# EAGLE board TurboMaster-clean_noart (EAGLE 7.7.0)
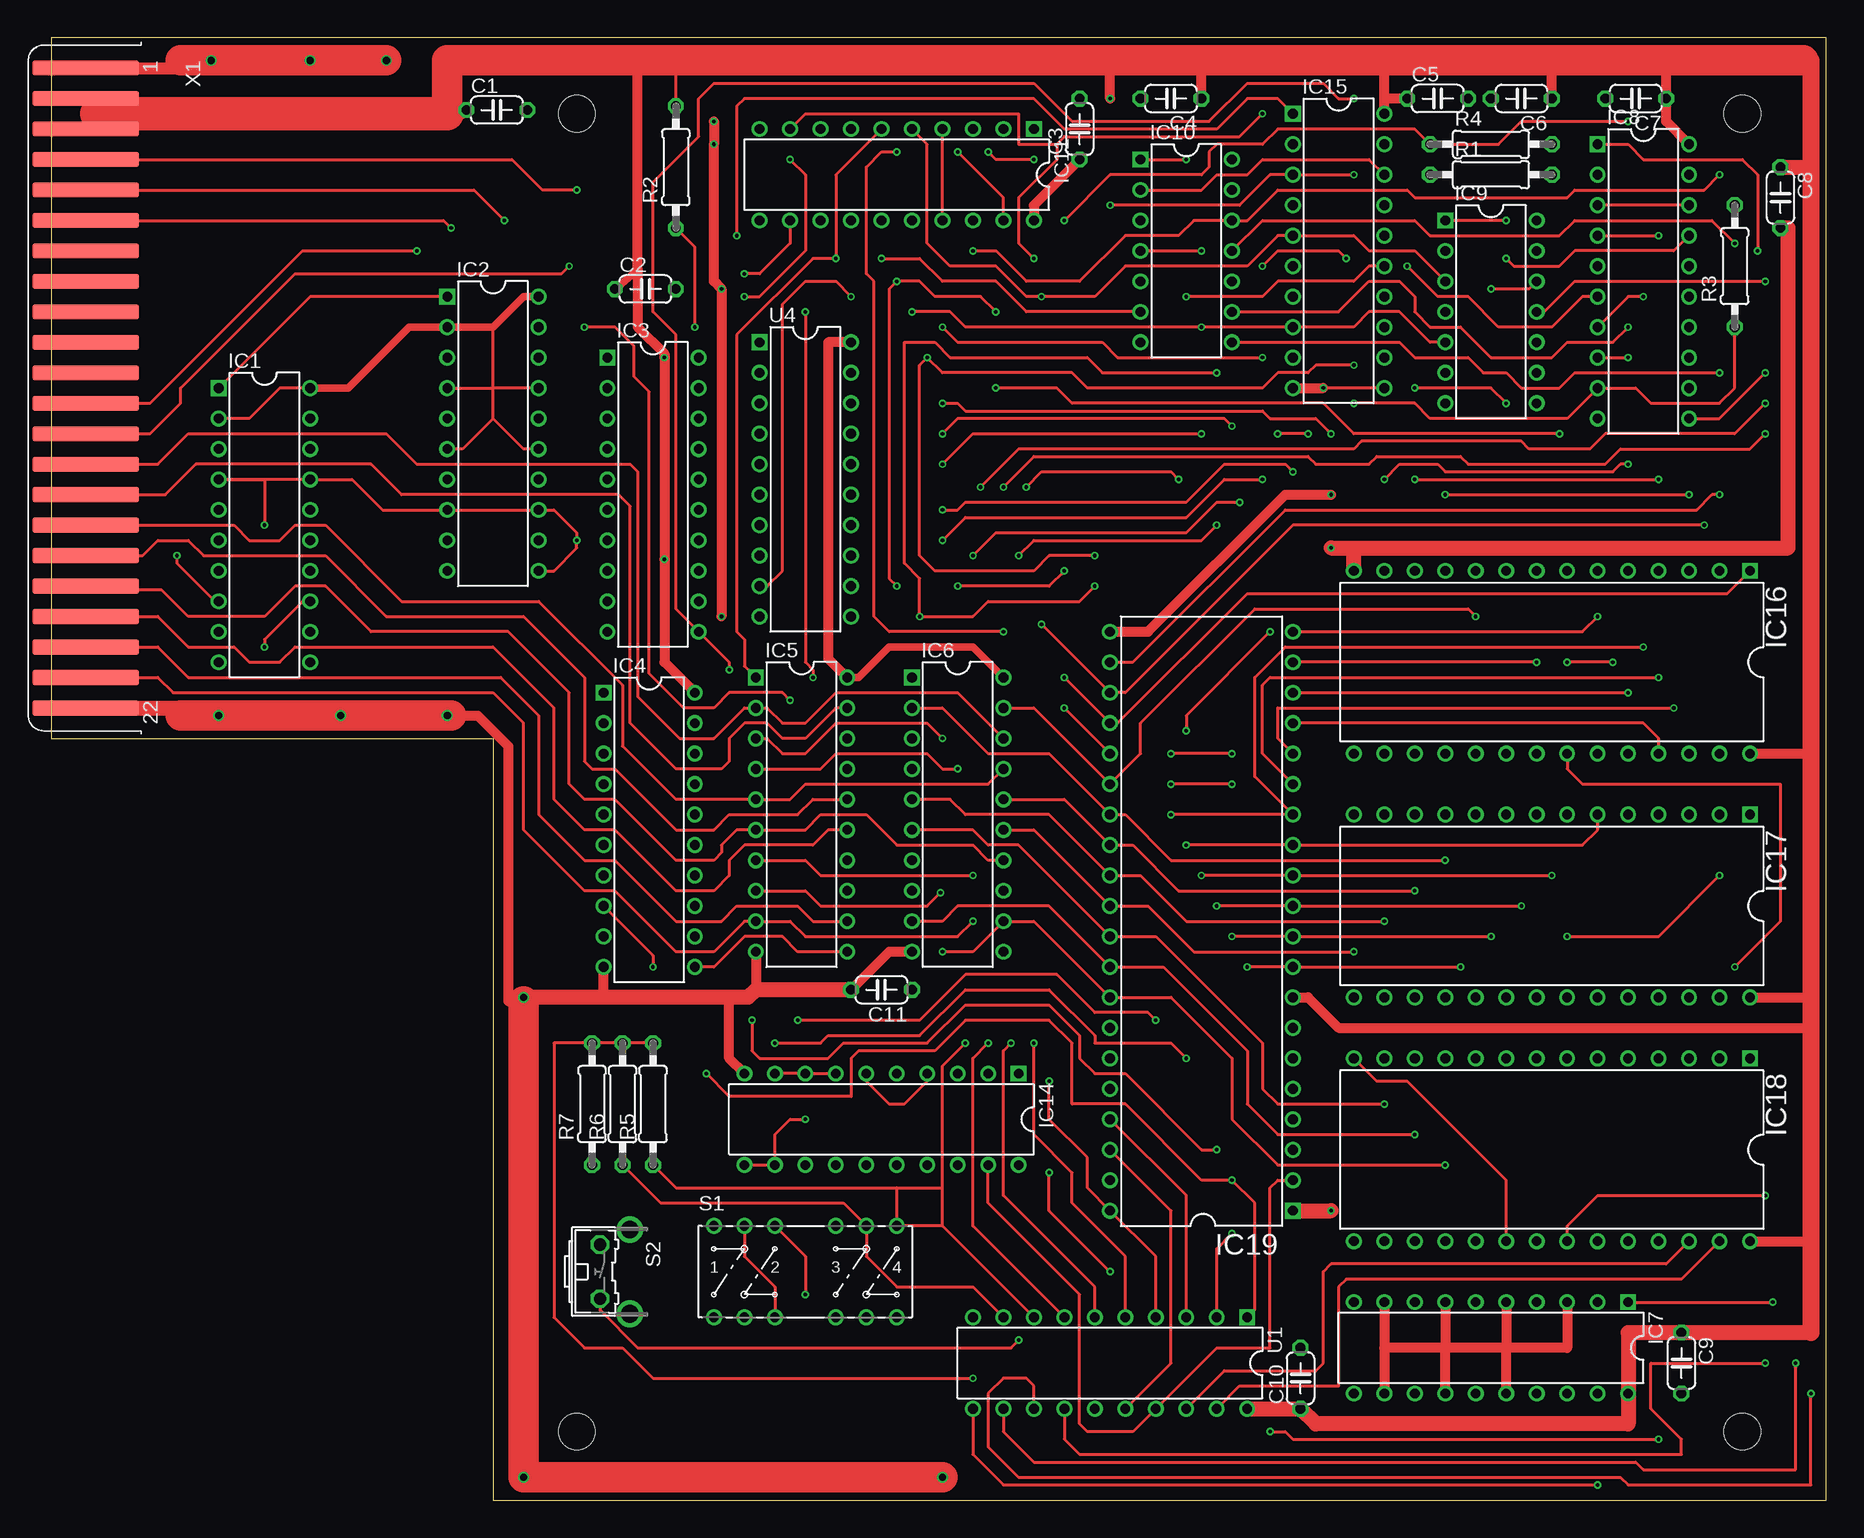
[diagram p2: board, top side]
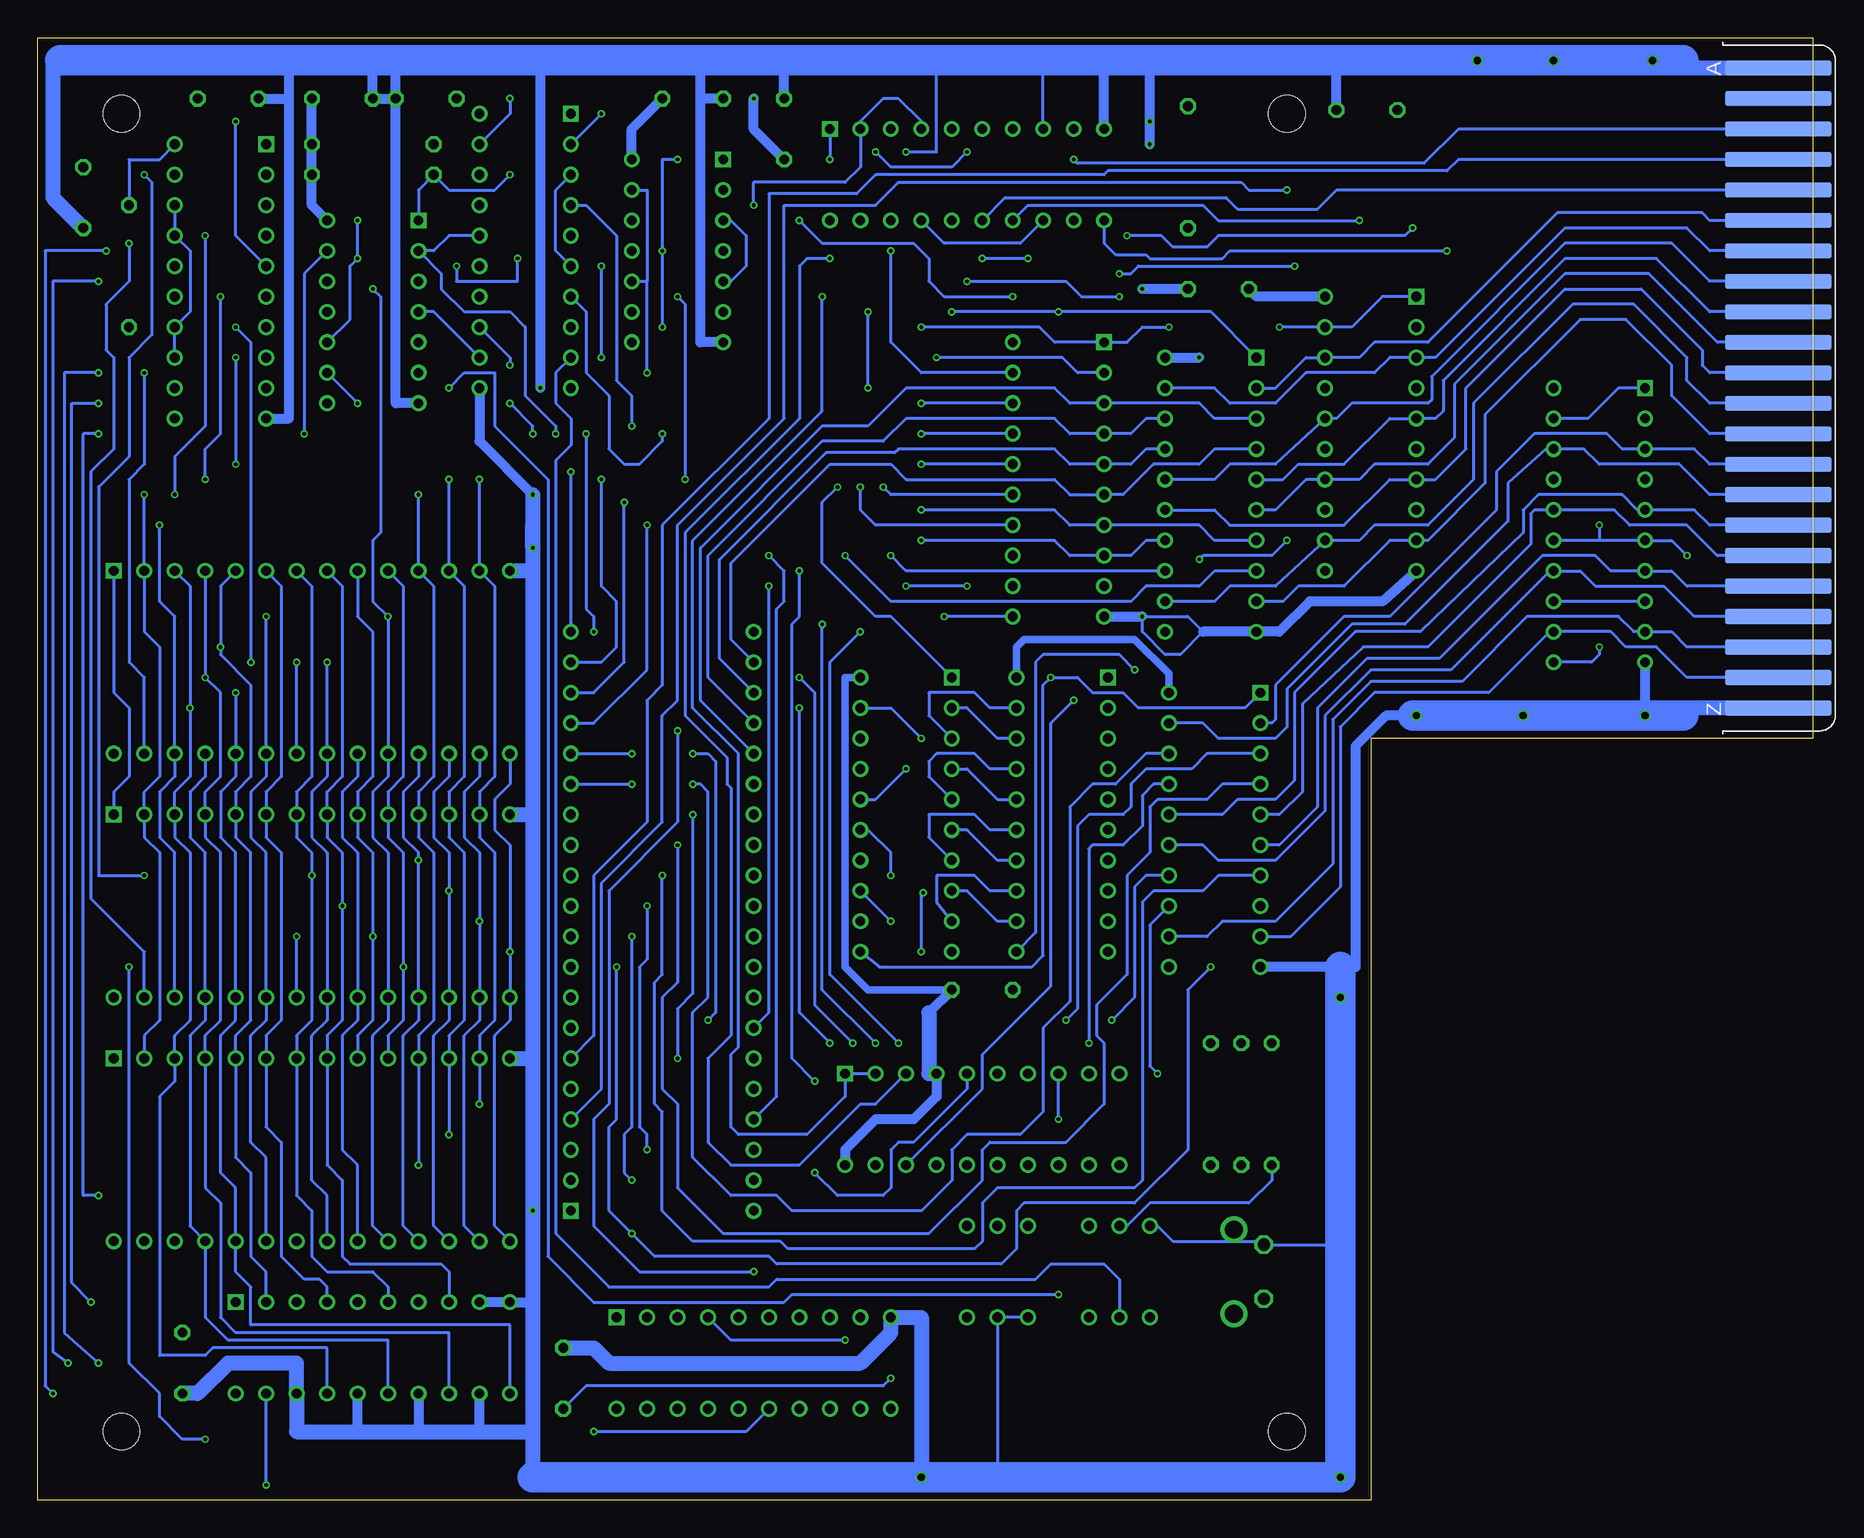
[diagram p3: board, bottom side, seen from below]

Size 147.96 x 121.92 mm. Coordinates in mm from the lower left corner, seen from the top.
Outline: 36.83,0 147.96,0 147.96,121.92 0,121.92 0,63.5 36.83,63.5 36.83,0
Copper layers (1*16): Top 0.035mm / dielectric 1.5mm / Bottom 0.035mm
Design rules "hackvana": minimum track width 6mil, minimum drill 0.3mm, track to track 6mil, track to pad 6mil, pad to pad 6mil, via to via 6mil, smd to smd 0mil, copper to edge 6mil, drill to drill 6mil, minimum pad ring 10mil, minimum via ring 6mil, stop-mask expansion 2mil, vias tented up to drill 100mil, thermal gap 10mil
Holes 3.05 mm at 140.97,5.71 43.81,5.71 43.81,115.57 140.97,115.57

## Footprints (pad centres in the part's own frame; a part is rotated, then mirrored left to right if it is on the bottom)
C050-024X044 = drill 0.813 octagon: 1 -2.54,0; 2 2.54,0
DIL20-RP = drill 0.813 square: 1 -11.43,-3.81 | drill 0.813: 2 -8.89,-3.81; 3 -6.35,-3.81; 4 -3.81,-3.81; 5 -1.27,-3.81; 6 1.27,-3.81; 7 3.81,-3.81; 8 6.35,-3.81; 9 8.89,-3.81; 10 11.43,-3.81; 11 11.43,3.81; 12 8.89,3.81; 13 6.35,3.81; 14 3.81,3.81; 15 1.27,3.81; 16 -1.27,3.81; 17 -3.81,3.81; 18 -6.35,3.81; 19 -8.89,3.81; 20 -11.43,3.81
DIL14-RP = drill 0.813 square: 1 -7.62,-3.81 | drill 0.813: 2 -5.08,-3.81; 3 -2.54,-3.81; 4 0,-3.81; 5 2.54,-3.81; 6 5.08,-3.81; 7 7.62,-3.81; 8 7.62,3.81; 9 5.08,3.81; 10 2.54,3.81; 11 0,3.81; 12 -2.54,3.81; 13 -5.08,3.81; 14 -7.62,3.81
DIL28-6-RP = drill 0.813 square: 1 -16.51,-7.62 | drill 0.813: 2 -13.97,-7.62; 3 -11.43,-7.62; 4 -8.89,-7.62; 5 -6.35,-7.62; 6 -3.81,-7.62; 7 -1.27,-7.62; 8 1.27,-7.62; 9 3.81,-7.62; 10 6.35,-7.62; 11 8.89,-7.62; 12 11.43,-7.62; 13 13.97,-7.62; 14 16.51,-7.62; 15 16.51,7.62; 16 13.97,7.62; 17 11.43,7.62; 18 8.89,7.62; 19 6.35,7.62; 20 3.81,7.62; 21 1.27,7.62; 22 -1.27,7.62; 23 -3.81,7.62; 24 -6.35,7.62; 25 -8.89,7.62; 26 -11.43,7.62; 27 -13.97,7.62; 28 -16.51,7.62
DIL40-ROUNDPAD = drill 0.813 square: 1 -24.13,-7.62 | drill 0.813: 2 -21.59,-7.62; 3 -19.05,-7.62; 4 -16.51,-7.62; 5 -13.97,-7.62; 6 -11.43,-7.62; 7 -8.89,-7.62; 8 -6.35,-7.62; 9 -3.81,-7.62; 10 -1.27,-7.62; 11 1.27,-7.62; 12 3.81,-7.62; 13 6.35,-7.62; 14 8.89,-7.62; 15 11.43,-7.62; 16 13.97,-7.62; 17 16.51,-7.62; 18 19.05,-7.62; 19 21.59,-7.62; 20 24.13,-7.62; 21 24.13,7.62; 22 21.59,7.62; 23 19.05,7.62; 24 16.51,7.62; 25 13.97,7.62; 26 11.43,7.62; 27 8.89,7.62; 28 6.35,7.62; 29 3.81,7.62; 30 1.27,7.62; 31 -1.27,7.62; 32 -3.81,7.62; 33 -6.35,7.62; 34 -8.89,7.62; 35 -11.43,7.62; 36 -13.97,7.62; 37 -16.51,7.62; 38 -19.05,7.62; 39 -21.59,7.62; 40 -24.13,7.62
0207/10 = drill 0.813 octagon: 1 -5.08,0; 2 5.08,0
DIP04DPDTS-RP = drill 0.813: 1 -7.62,-3.81; 2 -5.08,-3.81; 3 -2.54,-3.81; 5 2.54,-3.81; 6 5.08,-3.81; 7 7.62,-3.81; 8 7.62,3.81; 9 5.08,3.81; 10 2.54,3.81; 12 -2.54,3.81; 13 -5.08,3.81; 14 -7.62,3.81
B3F-31XX = drill 1.016 octagon: 1 -2.261,-1.245; 2 2.261,-1.245 | drill 1.499 pad 2.159: 3 -3.505,1.245; 4 3.505,1.245
MA100-22-2 = smd 1.27 x 8.89: 1 -26.67,-0.305; 2 -24.13,-0.305; 3 -21.59,-0.305; 4 -19.05,-0.305; 5 -16.51,-0.305; 6 -13.97,-0.305; 7 -11.43,-0.305; 8 -8.89,-0.305; 9 -6.35,-0.305; 10 -3.81,-0.305; 11 -1.27,-0.305; 12 1.27,-0.305; 13 3.81,-0.305; 14 6.35,-0.305; 15 8.89,-0.305; 16 11.43,-0.305; 17 13.97,-0.305; 18 16.51,-0.305; 19 19.05,-0.305; 20 21.59,-0.305; 21 24.13,-0.305; 22 26.67,-0.305 | smd 1.27 x 8.89 bottom: A -26.67,-0.305; B -24.13,-0.305; C -21.59,-0.305; D -19.05,-0.305; E -16.51,-0.305; F -13.97,-0.305; H -11.43,-0.305; J -8.89,-0.305; K -6.35,-0.305; L -3.81,-0.305; M -1.27,-0.305; N 1.27,-0.305; P 3.81,-0.305; R 6.35,-0.305; S 8.89,-0.305; T 11.43,-0.305; U 13.97,-0.305; V 16.51,-0.305; W 19.05,-0.305; X 21.59,-0.305; Y 24.13,-0.305; Z 26.67,-0.305

## Placement (x,y rotation side)
C1  10  [C050-024X044]  37.15,115.89 0 top
C2  .1  [C050-024X044]  49.53,100.96 0 top
C3  .1  [C050-024X044]  85.72,114.3 90 top
C4  .1  [C050-024X044]  93.34,116.84 180 top
C5  .1  [C050-024X044]  115.57,116.84 0 top
C6  .1  [C050-024X044]  122.56,116.84 180 top
C7  .1  [C050-024X044]  132.08,116.84 180 top
C8  .1  [C050-024X044]  144.15,108.58 270 top
C9  .1  [C050-024X044]  135.89,11.43 270 top
C10  .1  [C050-024X044]  104.14,10.16 90 top
C11  .1  [C050-024X044]  69.22,42.54 180 top
IC1  74HCT244N  [DIL20-RP]  17.78,81.28 270 top
IC2  74HCT244N  [DIL20-RP]  36.83,88.9 270 top
IC3  74HCT374N  [DIL20-RP]  50.16,83.82 270 top
IC4  74HCT374N  [DIL20-RP]  49.85,55.88 270 top
IC5  74HCT374N  [DIL20-RP]  62.55,57.15 270 top
IC6  74HCT374N  [DIL20-RP]  75.56,57.15 270 top
IC7  74HCT688N  [DIL20-RP]  120.02,12.7 180 top
IC8  74HCT374N  [DIL20-RP]  132.72,101.6 270 top
IC9  74HCT74N  [DIL14-RP]  120.02,99.06 270 top
IC10  74HCT32N  [DIL14-RP]  94.61,104.14 270 top
IC11  74HCT244N  [DIL20-RP]  70.48,110.49 180 top
IC14  [DIL20-RP]  69.22,31.75 180 top
IC15  [DIL20-RP]  107.31,104.14 270 top
IC16  62256  [DIL28-6-RP]  125.09,69.85 180 top
IC17  62256  [DIL28-6-RP]  125.09,49.53 180 top
IC18  27C256  [DIL28-6-RP]  125.09,29.21 180 top
IC19  65C02  [DIL40-ROUNDPAD]  95.89,48.26 90 top
R1  [0207/10]  120.02,110.49 0 top
R2  [0207/10]  52.07,111.12 90 top
R3  [0207/10]  140.34,102.87 90 top
R4  [0207/10]  120.02,113.03 0 top
R5  [0207/10]  50.16,33.02 90 top
R6  [0207/10]  47.62,33.02 90 top
R7  [0207/10]  45.09,33.02 90 top
S1  [DIP04DPDTS-RP]  62.87,19.05 0 top
S2  [B3F-31XX]  46.99,19.05 270 top
U1  [DIL20-RP]  88.27,11.43 180 top
U4  [DIL20-RP]  62.87,85.09 270 top
X1  EXPANSION_PORT_C64_EDGE  [MA100-22-2]  3.17,92.71 270 top

## Tracks (layer width: path | path; a pad name or v marks a point on that pad's centre or on a via)
64A0
  Bottom 0.254: IC4.9 43.5,46.99 39.37,51.12 39.37,64.45 36.51,67.31 26.99,67.31 21.91,72.39 IC1.12 16.83,72.39 15.56,71.12 13.02,71.12 10.48,68.58 X1.Y
64A1
  Bottom 0.254: IC4.12 50.48,46.99 49.21,48.26 44.77,48.26 40.01,53.02 40.01,65.09 36.83,68.26 29.21,68.26 23.81,73.66 16.19,73.66 14.92,72.39 IC1.9 11.75,72.39 10.48,71.12 X1.X
64A2
  Bottom 0.254: IC4.15 50.8,54.61 49.53,53.34 44.77,53.34 40.64,57.47 40.64,65.41 36.83,69.21 30.16,69.21 21.91,77.47 IC1.14 19.37,77.47 18.1,76.2 12.38,76.2 9.84,73.66 X1.W
64A3
  Bottom 0.254: IC4.6 44.45,54.61 41.27,57.78 41.27,66.04 37.15,70.17 31.11,70.17 22.54,78.74 18.1,78.74 16.83,77.47 IC1.7 11.75,77.47 10.48,76.2 X1.V
64A4
  Bottom 0.254: IC4.5 44.45,57.15 42.55,59.05 42.55,66.36 37.47,71.12 32.07,71.12 23.5,79.69 23.5,82.23 23.18,82.55 IC1.16 16.51,82.55 15.24,81.28 10.48,81.28 7.94,78.74 X1.U
64A5
  Bottom 0.254: IC4.16 49.21,57.15 47.94,58.42 44.77,58.42 43.18,60.01 43.18,67.31 38.1,72.39 32.7,72.39 24.13,80.64 24.13,82.55 22.86,83.82 15.88,83.82 14.61,82.55 IC1.5 9.84,82.55 8.57,81.28 X1.T
64A6
  Bottom 0.254: IC4.19 50.8,64.77 49.53,63.5 44.77,63.5 43.81,64.45 43.81,67.63 38.42,73.02 33.97,73.02 25.4,81.6 25.4,84.77 22.23,87.63 IC1.18 19.05,87.63 17.78,86.36 11.11,86.36 8.57,83.82 X1.S
64A7
  Bottom 0.254: IC4.2 45.09,64.77 44.77,65.09 44.77,67.94 39.05,73.66 35.24,73.66 26.35,82.55 26.35,85.72 23.18,88.9 17.14,88.9 15.88,87.63 IC1.3 9.84,87.63 8.57,86.36 X1.R
64A8
  Bottom 0.254: IC3.9 44.13,74.93 42.86,76.2 39.05,76.2 35.24,80.01 IC2.9 32.07,80.01 27.3,84.77 27.3,90.49 19.37,98.42 15.56,98.42 11.75,94.61 11.75,92.07 8.57,88.9 X1.P
64A9
  Bottom 0.254: IC3.12 49.85,74.93 48.58,76.2 44.77,76.2 IC2.12 37.78,80.01 36.51,81.28 32.07,81.28 28.26,85.09 28.26,91.44 20,99.69 14.92,99.69 10.48,95.25 10.48,93.34 8.57,91.44 X1.N
64A10
  Bottom 0.254: IC3.15 49.85,82.55 48.58,81.28 39.05,81.28 35.24,85.09 IC2.7 31.43,85.09 28.89,87.63 28.89,92.71 20.64,100.96 14.29,100.96 9.21,95.88 9.21,94.61 8.57,93.98 X1.M
64A11
  Bottom 0.254: IC3.6 44.77,82.55 42.23,85.09 IC2.14 37.78,85.09 36.51,86.36 32.07,86.36 29.84,88.58 29.84,93.03 20.64,102.23 13.65,102.23 7.94,96.52 X1.L
64A12
  Bottom 0.254: IC3.5 44.13,85.09 42.86,86.36 39.05,86.36 35.24,90.17 IC2.5 31.43,90.17 30.8,90.8 30.8,93.34 20.64,103.5 13.02,103.5 8.57,99.06 X1.K
64A13
  Bottom 0.254: IC3.16 49.85,85.09 48.58,86.36 44.77,86.36 IC2.16 39.69,90.17 38.42,91.44 32.07,91.44 31.75,91.76 31.75,93.66 20.64,104.77 11.75,104.77 8.57,101.6 X1.J
64A14
  Bottom 0.254: IC3.19 49.85,92.71 48.58,91.44 44.77,91.44 42.23,93.98 36.51,93.98 35.24,95.25 IC2.3 31.43,95.25 20.64,106.04 10.48,106.04 8.57,104.14 X1.H
64A15
  Bottom 0.254: IC3.2 44.77,92.71 42.23,95.25 IC2.18 37.78,95.25 36.51,96.52 32.07,96.52 21.27,107.31 9.21,107.31 8.57,106.68 X1.F
64BA  (via drill 0.3)
  Top 0.254: v30.48,104.14 20.95,104.14 8.26,91.44 X1.12
  Bottom 0.254: IC11.11 59.05,104.77 58.1,103.82 55.56,103.82 55.24,103.5 49.21,103.5 48.58,104.14 v30.48,104.14
64D0  (via drill 0.3)
  Top 0.254: v76.83,48.26 75.56,46.99 62.87,46.99 61.59,48.26 IC5.9 57.78,48.26 55.24,45.72 52.07,45.72 46.99,50.8 44.45,50.8 39.37,55.88 39.37,64.77 36.83,67.31 10.16,67.31 8.89,68.58 X1.21
  Bottom 0.254: IC6.13 v76.83,48.26
64D1
  Top 0.254: IC5.12 63.5,48.26 62.23,49.53 57.15,49.53 55.88,48.26 52.07,48.26 46.99,53.34 44.45,53.34 40.64,57.15 40.64,65.41 37.47,68.58 11.43,68.58 8.89,71.12 X1.20
  Bottom 0.254: IC5.12 67.94,48.26 70.48,50.8 IC6.8
64D2
  Top 0.254: IC5.15 64.77,55.88 63.5,54.61 57.78,54.61 56.52,53.34 56.52,52.07 55.24,50.8 52.07,50.8 46.99,55.88 44.45,55.88 41.91,58.42 41.91,66.04 36.83,71.12 20.32,71.12 19.05,69.85 16.51,69.85 15.24,71.12 11.43,71.12 8.89,73.66 X1.19
  Bottom 0.254: IC5.15 68.58,55.88 69.85,57.15 73.66,57.15 73.66,55.24 IC6.7
64D3
  Top 0.254: IC6.14 78.11,53.34 76.83,54.61 70.48,54.61 67.94,57.15 64.14,57.15 62.87,55.88 IC5.6 57.15,55.88 55.88,54.61 55.88,53.97 55.24,53.34 52.07,53.34 46.99,58.42 44.45,58.42 43.18,59.69 43.18,67.31 38.1,72.39 26.67,72.39 22.86,76.2 20.32,76.2 17.78,73.66 11.43,73.66 9.21,75.88 7.3,75.88 6.99,76.2 X1.18
64D4
  Top 0.254: IC5.16 63.5,58.42 62.23,57.15 56.52,57.15 55.24,55.88 52.07,55.88 46.99,60.96 45.09,60.96 44.45,61.59 44.45,68.58 39.37,73.66 27.94,73.66 22.86,78.74 12.7,78.74 11.43,80.01 8.89,80.01 7.62,78.74 X1.17
  Bottom 0.254: IC6.4 70.48,60.96 67.94,58.42 IC5.16
64D5
  Top 0.254: IC6.17 78.11,59.69 62.87,59.69 61.59,58.42 IC5.5 52.07,58.42 47.62,62.86 47.62,67.94 40.64,74.93 29.21,74.93 22.86,81.28 20.32,81.28 19.05,80.01 16.51,80.01 15.24,81.28 X1.16
64D6
  Top 0.254: IC5.19 65.41,66.04 62.87,63.5 60.96,63.5 59.69,64.77 57.78,64.77 56.52,63.5 56.52,61.59 55.88,60.96 52.07,60.96 48.26,64.77 48.26,82.87 47.31,83.82 29.21,83.82 26.67,86.36 12.06,86.36 9.53,83.82 X1.15
  Bottom 0.254: IC5.19 68.58,66.04 69.85,67.31 73.66,67.31 73.66,65.41 IC6.3
64D7
  Top 0.254: IC6.18 75.56,67.31 65.41,67.31 62.87,64.77 60.96,64.77 59.69,66.04 IC5.2 57.78,66.04 55.24,63.5 52.39,63.5 48.9,66.99 48.9,85.72 48.26,86.36 30.48,86.36 27.94,88.9 11.43,88.9 8.89,86.36 X1.14
64DMA  (via drill 0.3)
  Top 0.254: IC11.12 61.59,104.77 59.05,102.23 v57.78,102.23 | v43.18,102.87 42.55,102.23 20.32,102.23 10.79,92.71 10.79,91.44 8.26,88.9 X1.13
  Bottom 0.254: v57.78,102.23 56.83,102.23 56.2,102.87 v43.18,102.87
64PHI2
  Bottom 0.254: IC11.15 67.31,108.58 48.9,108.58 47.94,107.63 41.27,107.63 39.69,109.22 X1.E
64R/!W  (via drill 0.3)
  Top 0.254: v37.78,106.68 35.24,109.22 X1.5
  Bottom 0.254: IC11.14 65.41,107.95 50.8,107.95 49.53,106.68 v37.78,106.68
!=00000000000000XX  (via drill 0.3)
  Top 0.254: U1.11 76.83,3.81 79.38,1.27 v128.91,1.27
  Bottom 0.254: v128.91,1.27 IC7.19
!=000000XXXXXXXXXX  (via drill 0.3)
  Top 0.254: v142.88,91.44 140.34,88.9 129.54,88.9 128.27,87.63 123.19,87.63 122.56,88.26 109.22,88.26 108.58,87.63 80.64,87.63 v77.47,84.45 | IC7.1 v143.51,16.51
  Bottom 0.254: U4.15 76.83,83.82 v77.47,84.45 | v142.88,91.44 145.1,91.44 145.1,18.1 v143.51,16.51
!ACCESS_IO  (via drill 0.3)
  Top 0.254: v98.42,89.53 97.79,90.17 75.56,90.17 v74.3,88.9
  Bottom 0.254: U4.17 v74.3,88.9 | IC15.4 102.23,107.95 99.69,105.41 99.69,93.34 98.42,92.07 v98.42,89.53
!CE_RAM1  (via drill 0.3)
  Top 0.254: v101.6,5.71 102.87,5.71 103.5,5.08 v133.99,5.08 | IC10.9 107.31,99.06 109.86,101.6 112.39,101.6 113.67,100.33 113.67,99.06 114.94,97.79 117.47,97.79 120.02,95.25 125.09,95.25 126.36,96.52 130.18,96.52 v131.44,97.79 | IC16.22 126.36,60.96 127.64,59.69 144.15,59.69 144.15,48.26 v140.34,44.45 | v130.18,69.85 v126.36,69.85
  Bottom 0.254: IC16.22 v126.36,69.85 | U1.15 88.9,5.71 v101.6,5.71 | v131.44,97.79 130.18,96.52 v130.18,69.85 | v133.99,5.08 135.89,5.08 137.79,6.98 137.79,8.89 140.34,11.43 v140.34,44.45
!CE_RAM2  (via drill 0.3)
  Top 0.254: v126.36,46.99 133.99,46.99 v139.06,52.07 | v76.83,104.14 78.74,104.14 81.28,101.6 85.72,101.6 89.53,105.41 93.98,105.41 95.25,106.68 IC10.12 99.69,106.68 102.23,109.22 113.03,109.22 113.67,108.58 126.36,108.58 127,109.22 137.79,109.22 v139.06,110.49
  Bottom 0.254: U4.19 74.3,93.98 76.83,96.52 v76.83,104.14 | IC17.22 v126.36,46.99 | v139.06,110.49 138.43,109.85 138.43,97.16 140.34,95.25 140.34,86.99 142.88,84.45 142.88,52.07 v139.06,52.07
!EN_0001  (via drill 0.3)
  Top 0.254: U1.13 81.92,9.52 81.28,10.16 79.38,10.16 78.11,8.89 78.11,4.44 80.64,1.9 130.81,1.9 131.44,1.27 146.69,1.27 v146.69,8.89 | IC8.1 131.44,113.03 132.72,111.76 140.97,111.76 142.24,110.49 v142.24,104.14
  Bottom 0.254: v142.24,104.14 147.32,104.14 147.32,9.52 v146.69,8.89
!EN_ADDR_TO_64  (via drill 0.3)
  Top 0.254: IC9.5 114.94,96.52 112.39,99.06 109.86,99.06 108.58,97.79 IC15.8 v95.89,97.79 76.2,97.79 74.93,99.06 v71.75,99.06 | IC10.4 v95.89,104.14 | IC10.1 v94.61,111.76 | v62.87,99.06 62.87,69.85 63.5,69.21 v63.5,68.58
  Bottom 0.254: IC4.1 47.31,66.04 56.2,66.04 57.47,67.31 60.01,67.31 61.28,68.58 v63.5,68.58 64.14,67.94 64.14,45.4 65.09,44.45 77.79,44.45 IC6.11 | v71.75,99.06 v62.87,99.06 50.16,99.06 IC3.1 | v95.89,97.79 v95.89,104.14 95.89,111.76 v94.61,111.76
!EN_DATA_TO_64  (via drill 0.3)
  Top 0.254: IC11.6 65.41,110.49 v65.41,103.5 63.5,103.5 57.15,97.16 57.15,72.39 57.78,71.75 57.78,69.53 IC5.1 | IC10.6 81.28,99.06 78.74,101.6 74.3,101.6 72.39,103.5 v69.22,103.5
  Bottom 0.254: v65.41,103.5 v69.22,103.5
!FLAG_CHAREN  (via drill 0.3)
  Top 0.254: R3.1 140.34,92.71 139.06,91.44 133.35,91.44 132.08,92.71 IC8.9 126.36,90.17 114.94,90.17 113.67,91.44 v108.58,91.44 | v74.3,91.44 75.56,91.44 76.2,90.8 100.97,90.8 101.6,90.17 105.41,90.17 v106.68,88.9
  Bottom 0.254: U4.18 v74.3,91.44 | v106.68,88.9 106.68,89.53 v108.58,91.44
!FLAG_HIRAM  (via drill 0.3)
  Top 0.254: v53.66,97.79 53.66,104.46 R2.1 | IC8.6 127.64,100.33 125.09,97.79 120.65,97.79 118.11,100.33 115.57,100.33 v113.03,102.87 | v74.3,97.79 75.56,96.52 87.63,96.52 88.9,95.25 v100.97,95.25 | v100.97,102.87 102.23,104.14 107.31,104.14 v107.95,103.5
  Bottom 0.254: v53.66,97.79 55.88,97.79 57.15,96.52 U4.1 63.18,96.52 64.45,97.79 v74.3,97.79 | v113.03,102.87 113.03,101.6 107.95,101.6 v107.95,103.5 | v100.97,95.25 v100.97,102.87
!FLAG_LORAM  (via drill 0.3)
  Top 0.254: v84.45,106.68 88.27,110.49 95.89,110.49 96.52,111.12 96.52,112.39 97.16,113.03 100.97,113.03 102.23,114.3 113.67,114.3 R4.1 120.65,113.03 122.56,114.94 v131.44,114.94 | U4.9 59.69,76.2 60.96,77.47 60.96,99.69 62.87,101.6 65.41,101.6 v66.67,100.33
  Bottom 0.254: IC8.5 131.44,105.41 v131.44,114.94 | v84.45,106.68 82.55,104.77 74.93,104.77 73.66,103.5 73.66,101.6 72.39,100.33 v66.67,100.33
!IRQ  (via drill 0.3)
  Top 0.254: v43.81,109.22 40.96,109.22 38.42,111.76 X1.4
  Bottom 0.254: IC19.4 100.97,34.29 100.97,51.43 95.89,56.51 95.89,65.41 94.61,66.67 94.61,81.28 85.72,90.17 85.72,107.95 78.11,107.95 76.2,109.85 47.62,109.85 46.99,109.22 v43.81,109.22
!LATCH_DATA_FROM_64  (via drill 0.3)
  Top 0.254: IC15.15 109.86,102.87 108.58,101.6 102.23,101.6 100.97,100.33 v94.61,100.33 | v81.28,84.45 82.55,85.72 93.34,85.72 v93.98,85.09
  Bottom 0.254: IC6.1 76.83,73.66 78.11,73.66 82.55,78.1 82.55,83.18 v81.28,84.45 | v94.61,100.33 93.98,99.69 v93.98,85.09
!NMI
  Bottom 0.254: IC19.6 101.6,38.73 101.6,52.07 97.16,56.51 97.16,66.67 95.89,67.94 95.89,81.28 87,90.17 87,108.9 79.69,108.9 78.11,110.49 59.05,110.49 58.74,110.81 30.48,110.81 29.53,111.76 X1.D
!OE_ROM  (via drill 0.3)
  Top 0.254: IC18.22 126.36,22.86 128.91,25.4 v142.88,25.4 | v79.38,84.45 81.92,86.99 104.78,86.99 105.41,86.36 109.86,86.36 110.49,86.99 117.47,86.99 118.11,86.36 129.54,86.36 130.81,87.63 141.6,87.63 v142.88,88.9
  Bottom 0.254: U4.14 78.11,81.28 79.38,82.55 v79.38,84.45 | v142.88,25.4 144.15,25.4 144.15,88.9 v142.88,88.9
!RDY
  Top 0.254: IC19.2 102.23,26.67 101.6,26.03 101.6,12.7 97.16,12.7 U1.17 90.17,5.71 86.36,5.71 85.72,6.35 85.72,17.14 78.11,24.77 IC14.19
!RESET  (via drill 0.3)
  Top 0.254: U1.4 92.08,20.32 IC19.40 86.36,26.03 86.36,28.57 83.19,31.75 v83.19,34.92 | v125.73,88.9 108.58,88.9 106.05,91.44 85.09,91.44 83.82,92.71 v78.74,92.71 | v61.59,111.76 62.87,110.49 62.87,104.14 59.05,100.33 v57.78,100.33 | v84.45,77.47 83.19,76.2 v75.56,76.2 | S2.2 45.74,15.85 48.9,12.7 80.01,12.7 v80.64,13.33 | v78.74,99.06 77.47,100.33 73.66,100.33 72.39,101.6 v70.48,101.6 69.85,100.96 69.85,76.83 v70.48,76.2
  Bottom 0.254: IC9.13 125.73,102.23 v125.73,88.9 | v83.19,34.92 85.09,36.83 85.09,73.02 84.45,73.66 v84.45,77.47 | v61.59,111.76 61.28,111.44 32.38,111.44 29.53,114.3 X1.C | v78.74,92.71 v78.74,99.06 | v70.48,101.6 62.23,101.6 60.96,100.33 v57.78,100.33 | v80.64,13.33 90.17,13.33 U1.4 | v70.48,76.2 v75.56,76.2
!SO
  Top 0.254: U1.16 93.34,11.43 93.34,24.13 IC19.38
!WE_RAM1  (via drill 0.3)
  Top 0.254: IC10.8 112.39,96.52 113.67,95.25 118.11,95.25 119.38,93.98 121.28,93.98 122.56,92.71 125.73,92.71 127,93.98 v139.06,93.98
  Bottom 0.254: IC16.27 139.06,68.58 140.34,69.85 140.34,85.09 139.06,86.36 v139.06,93.98
!WE_RAM2  (via drill 0.3)
  Top 0.254: IC10.11 100.97,106.68 113.67,106.68 114.94,105.41 125.73,105.41 127,106.68 138.43,106.68 v140.34,104.77
  Bottom 0.254: IC17.27 139.06,45.72 143.51,50.16 143.51,85.72 141.6,87.63 141.6,95.25 142.24,95.88 142.24,99.69 140.34,101.6 v140.34,104.77
!WR_DXXX  (via drill 0.3)
  Top 0.254: v74.3,86.36 76.83,88.9 v95.89,88.9
  Bottom 0.254: U4.16 v74.3,86.36 | IC15.7 102.23,99.06 102.23,93.98 100.33,92.07 100.33,87.63 99.06,86.36 97.79,86.36 95.89,88.26 v95.89,88.9
A0  (via drill 0.3)
  Top 0.254: v117.47,44.45 IC19.9 v99.69,44.45 | U1.2 97.16,20.95 v98.42,22.22 | IC4.8 50.16,45.4 v50.16,44.45
  Bottom 0.254: IC16.10 117.47,76.2 117.47,60.32 118.75,59.05 IC17.10 118.75,55.24 117.47,53.97 v117.47,44.45 117.47,40 118.75,38.73 IC18.10 | v99.69,44.45 99.69,31.75 100.33,31.11 100.33,24.13 v98.42,22.22 96.52,20.32 87,20.32 86.36,19.68 67.63,19.68 66.36,20.95 66.36,24.13 65.72,24.77 56.52,24.77 52.07,29.21 52.07,42.54 v50.16,44.45
A1  (via drill 0.3)
  Top 0.254: v120.02,46.99 IC19.10 v98.42,46.99 | U1.1 100.33,15.88 100.33,24.77 v98.42,26.67 95.89,26.67 89.53,33.02 85.09,33.02 85.09,38.1 83.19,40 76.2,40 73.66,37.46 67.31,37.46 66.67,36.83 66.67,33.65 56.52,33.65 v54.61,35.56
  Bottom 0.254: IC16.9 121.28,73.66 120.02,72.39 120.02,60.32 121.28,59.05 IC17.9 121.28,55.24 120.02,53.97 v120.02,46.99 120.02,40 121.28,38.73 IC18.9 | IC4.13 55.24,47.94 55.24,36.19 v54.61,35.56 | v98.42,46.99 98.42,31.11 99.06,30.48 99.06,27.3 v98.42,26.67
A2  (via drill 0.3)
  Top 0.254: v97.16,49.53 IC19.11 v122.56,49.53 | v58.42,40 58.42,37.46 59.05,36.83 64.77,36.83 66.04,38.1 73.03,38.1 76.2,41.27 83.19,41.27 85.72,38.73 85.72,36.83 87,35.56 89.53,35.56 95.89,29.21 v97.16,29.21
  Bottom 0.254: IC16.8 122.56,76.2 122.56,60.32 123.83,59.05 IC17.8 123.83,55.24 122.56,53.97 v122.56,49.53 122.56,40 123.83,38.73 IC18.8 123.83,27.94 122.56,26.67 122.56,20.32 121.92,19.68 114.3,19.68 113.67,19.05 IC7.8 | IC4.14 55.56,52.07 56.52,51.12 56.52,41.91 v58.42,40 | v97.16,49.53 97.16,45.08 97.79,44.45 97.79,31.11 97.16,30.48 v97.16,29.21
A3  (via drill 0.3)
  Top 0.254: v95.89,52.07 IC19.12 v125.09,52.07
  Bottom 0.254: IC16.7 125.09,76.2 125.09,60.32 126.36,59.05 IC17.7 126.36,55.24 125.09,53.97 v125.09,52.07 125.09,40 126.36,38.73 IC18.7 126.36,25.4 125.09,24.13 125.09,20.32 123.83,19.05 120.02,19.05 118.75,17.78 IC7.6 | IC4.7 49.53,52.07 50.8,50.8 54.93,50.8 55.88,49.85 55.88,26.67 56.52,26.03 67.94,26.03 69.22,24.77 69.22,21.59 69.85,20.95 85.41,20.95 86.04,21.59 93.34,21.59 95.89,24.13 95.89,32.38 96.52,33.02 96.52,43.18 95.89,43.81 v95.89,52.07
A4  (via drill 0.3)
  Top 0.254: IC17.6 128.91,55.88 127.64,54.61 IC19.13 v94.61,54.61
  Bottom 0.254: IC4.4 49.21,59.69 50.48,58.42 54.61,58.42 55.24,57.78 55.24,53.97 57.15,52.07 57.15,43.81 59.69,41.27 59.69,38.73 59.05,38.1 59.05,33.02 62.23,29.84 68.58,29.84 69.22,29.21 69.22,26.67 73.66,22.22 90.81,22.22 94.61,26.03 94.61,33.02 95.89,34.29 95.89,41.91 94.61,43.18 v94.61,54.61 | IC16.6 127.64,76.2 127.64,60.32 128.91,59.05 IC17.6 128.91,55.24 127.64,53.97 127.64,40 128.91,38.73 IC18.6 128.91,31.11 127.64,29.84 127.64,20.32 125.73,18.41 124.46,18.41 123.83,17.78 IC7.4
A5  (via drill 0.3)
  Top 0.254: v132.72,71.12 102.87,71.12 100.33,68.58 100.33,60.32 IC19.14 v93.34,57.15 | v60.33,38.1 64.14,38.1 64.77,38.73 72.39,38.73 76.2,42.54 83.19,42.54 87,38.73 87,38.1 93.34,38.1 v94.61,36.83
  Bottom 0.254: IC4.17 54.93,59.69 55.88,58.74 55.88,56.2 57.47,54.61 60.01,54.61 60.33,54.29 v60.33,38.1 | IC16.5 132.72,76.2 v132.72,71.12 132.72,70.48 130.18,67.94 130.18,60.32 131.44,59.05 IC17.5 131.44,55.24 130.18,53.97 130.18,40 131.44,38.73 IC18.5 131.44,28.57 130.18,27.3 130.18,20.32 128.91,19.05 IC7.2 | v93.34,57.15 93.34,42.23 94.61,40.96 v94.61,36.83
A6  (via drill 0.3)
  Top 0.254: v98.42,59.69 v93.34,59.69 | IC19.15 100.97,62.23 100.97,67.94 101.6,68.58 v133.99,68.58
  Bottom 0.254: IC4.18 55.56,62.23 58.1,59.69 60.01,59.69 61.91,57.78 61.91,41.59 64.14,39.37 64.14,32.38 66.04,30.48 70.48,30.48 71.75,29.21 71.75,26.67 74.3,24.13 85.09,24.13 86.36,25.4 90.17,25.4 93.34,28.57 93.34,40.64 92.08,41.91 92.08,59.05 92.71,59.69 v93.34,59.69 | IC7.13 113.67,13.97 131.44,13.97 132.72,15.24 132.72,24.77 133.99,26.03 IC18.4 133.99,38.73 132.72,40 132.72,53.97 133.99,55.24 IC17.4 133.99,59.05 132.72,60.32 132.72,67.31 v133.99,68.58 IC16.4 | IC19.15 v98.42,59.69
A7  (via drill 0.3)
  Top 0.254: v98.42,62.23 v93.34,62.23 | IC19.16 102.23,63.5 102.23,66.04 v135.25,66.04 | v92.08,40 91.44,40.64 87,40.64 83.82,43.81 76.2,43.81 72.39,40 v62.23,40
  Bottom 0.254: IC4.3 50.48,62.23 51.75,60.96 55.56,60.96 56.83,59.69 56.83,57.78 57.47,57.15 60.33,57.15 61.28,56.2 61.28,40.96 v62.23,40 | IC16.3 135.25,76.2 v135.25,66.04 135.25,60.32 136.53,59.05 IC17.3 136.53,55.24 135.25,53.97 135.25,40 136.53,38.73 IC18.3 136.53,34.92 137.79,33.65 137.79,12.06 133.99,12.06 133.35,12.7 123.83,12.7 IC7.17 | IC19.16 v98.42,62.23 | v93.34,62.23 92.08,62.23 91.44,61.59 91.44,40.64 v92.08,40
A8  (via drill 0.3)
  Top 0.254: IC16.25 133.99,63.5 132.72,64.77 IC19.17 | v80.64,78.74 81.92,80.01 95.89,80.01 v97.16,81.28
  Bottom 0.254: IC3.8 49.85,77.47 51.12,76.2 55.56,76.2 56.83,74.93 76.83,74.93 v80.64,78.74 | IC16.25 133.99,60.32 135.25,59.05 135.25,55.24 133.99,53.97 IC17.25 133.99,40 135.25,38.73 135.25,22.86 IC18.25 133.99,15.24 132.08,13.33 118.75,13.33 IC7.15 | IC19.17 101.6,64.77 97.16,69.21 v97.16,81.28
A9  (via drill 0.3)
  Top 0.254: v76.83,78.74 78.74,80.64 94.61,80.64 97.16,83.18 v99.06,83.18 | IC19.18 v131.44,67.31
  Bottom 0.254: IC3.13 75.56,77.47 v76.83,78.74 | IC7.11 108.58,14.6 130.18,14.6 130.18,17.78 131.44,19.05 IC18.24 131.44,26.03 132.72,27.3 132.72,38.73 131.44,40 IC17.24 131.44,53.97 132.72,55.24 132.72,59.05 131.44,60.32 IC16.24 v131.44,67.31 | IC19.18 101.6,67.31 99.06,69.85 v99.06,83.18
A10  (via drill 0.3)
  Top 0.254: v74.3,80.01 76.2,81.91 94.61,81.91 97.79,85.09 v100.97,85.09 | v123.83,69.85 IC19.19
  Bottom 0.254: IC3.14 55.56,80.01 56.83,78.74 U4.8 61.91,78.74 63.18,80.01 v74.3,80.01 | v123.83,69.85 IC16.21 123.83,60.32 125.09,59.05 125.09,55.24 123.83,53.97 IC17.21 123.83,40 125.09,38.73 125.09,26.67 123.83,25.4 IC18.21 | IC19.19 100.97,69.85 99.69,71.12 99.69,74.93 100.97,76.2 v100.97,85.09
A11  (via drill 0.3)
  Top 0.254: v74.3,82.55 75.56,82.55 76.2,83.18 94.61,83.18 97.79,86.36 102.87,86.36 v103.5,85.72 | IC19.20 127.64,72.39 v128.91,73.66
  Bottom 0.254: IC3.7 49.85,80.01 51.12,81.28 U4.7 61.91,81.28 63.18,82.55 v74.3,82.55 | v128.91,73.66 IC16.23 128.91,60.32 130.18,59.05 130.18,55.24 128.91,53.97 IC17.23 128.91,40 130.18,38.73 130.18,29.84 128.91,28.57 IC18.23 | IC19.20 v103.5,85.72
A12  (via drill 0.3)
  Top 0.254: IC19.22 90.17,69.85 102.87,82.55 137.16,82.55 138.43,83.82 v139.06,83.82
  Bottom 0.254: IC3.4 49.85,87.63 51.12,86.36 54.93,86.36 57.47,83.82 U4.6 61.91,83.82 63.18,85.09 75.56,85.09 76.83,86.36 81.92,86.36 90.17,78.1 90.17,71.75 IC19.22 | IC18.2 139.06,38.73 137.79,40 137.79,53.97 139.06,55.24 IC17.2 139.06,59.05 137.79,60.32 137.79,71.12 139.06,72.39 IC16.2 v139.06,83.82
A13  (via drill 0.3)
  Top 0.254: U1.7 76.83,22.86 76.83,36.83 v78.11,38.1 | v82.55,73.02 IC19.23 89.53,67.31 103.5,81.28 v137.79,81.28
  Bottom 0.254: IC3.17 55.56,87.63 56.83,86.36 U4.5 61.91,86.36 63.18,87.63 76.2,87.63 76.52,87.31 82.23,87.31 91.12,78.42 91.12,70.17 IC19.23 | IC17.26 136.53,53.97 137.79,55.24 137.79,59.05 136.53,60.32 IC16.26 136.53,73.66 137.79,74.93 v137.79,81.28 | v78.11,38.1 82.55,42.54 v82.55,73.02
A13_ROM
  Top 0.254: IC18.26 134.62,19.68 106.68,19.68 106.05,19.05 106.05,11.43 105.41,10.79 97.79,10.79 U1.18
A14  (via drill 0.3)
  Top 0.254: U1.6 87,17.78 79.38,25.4 79.38,37.46 v80.01,38.1 | v84.45,68.58 IC19.24 88.9,64.77 99.69,75.56 139.7,75.56 IC16.1
  Bottom 0.254: IC3.18 55.56,90.17 56.83,88.9 U4.4 61.91,88.9 63.18,90.17 75.56,90.17 77.47,88.26 82.55,88.26 92.08,78.74 92.08,68.58 IC19.24 | IC16.1 141.6,67.31 140.34,66.04 140.34,60.32 141.6,59.05 IC17.1 | v84.45,68.58 83.19,67.31 83.19,41.27 v80.01,38.1
A14_ROM
  Top 0.254: IC18.27 135.89,18.41 107.95,18.41 107.31,17.78 107.31,9.52 99.06,9.52 U1.19
A15  (via drill 0.3)
  Top 0.254: U1.5 89.53,20.32 85.09,24.77 85.09,27.3 81.92,30.48 v81.92,38.1 | IC19.25 v84.45,66.04
  Bottom 0.254: IC3.3 49.85,90.17 51.12,91.44 U4.3 61.91,91.44 63.18,92.71 75.56,92.71 78.74,89.53 82.55,89.53 92.71,79.38 92.71,66.67 IC19.25 | v81.92,38.1 84.45,40.64 v84.45,66.04
B64BA  (via drill 0.3)
  Top 0.254: IC11.9 62.87,115.57 80.64,115.57 80.64,113.03 83.82,113.03 | 83.82,113.03 84.45,113.66 99.06,113.66 v100.97,115.57 | 83.82,113.03 83.82,111.76 80.64,108.58 80.64,104.77 v81.92,103.5
  Bottom 0.254: IC15.2 v100.97,115.57 | v81.92,103.5 83.82,103.5 84.45,102.87 84.45,90.17 93.98,80.64 93.98,65.41 90.49,61.91 90.49,59.69 90.17,59.37 90.17,38.73 92.08,36.83 92.08,29.84 90.17,27.94 84.45,27.94 79.38,33.02 78.11,33.02 IC14.3
B64PHI2  (via drill 0.3)
  Top 0.254: IC9.3 113.67,104.14 109.86,104.14 108.58,105.41 IC15.5 102.23,105.41 99.69,102.87 89.53,102.87 87,100.33 v82.55,100.33 81.28,100.33 78.74,102.87 74.93,102.87 73.03,104.77 73.03,113.03 IC11.5
  Bottom 0.254: IC14.2 IC14.1 80.64,33.65 83.82,30.48 89.53,30.48 90.17,31.11 90.17,37.15 89.53,37.78 89.53,62.23 93.34,66.04 93.34,80.01 82.55,90.8 v82.55,100.33
CLK_WR_0000  (via drill 0.3)
  Top 0.254: U1.12 79.38,5.71 81.92,3.17 132.08,3.17 132.72,2.54 145.41,2.54 v145.41,11.43 | IC9.11 124.46,99.06 127,101.6 v142.88,101.6
  Bottom 0.254: v142.88,101.6 146.69,101.6 146.69,12.38 v145.41,11.43
CLK_WR_0001  (via drill 0.3)
  Top 0.254: U1.14 84.45,5.08 85.72,3.81 135.89,3.81 135.89,5.08 133.35,7.62 133.35,11.43 v142.88,11.43 | IC8.11 139.06,90.17 v142.88,93.98
  Bottom 0.254: v142.88,93.98 145.73,93.98 145.73,13.97 v142.88,11.43
D0  (via drill 0.3)
  Top 0.254: IC8.4 v133.99,105.41 | v74.3,45.72 76.83,45.72 IC6.12 81.92,48.26 IC19.33 93.34,41.91 98.42,36.83 98.42,31.75 102.23,27.94 v116.2,27.94 | v116.2,83.82 v136.53,83.82 | IC5.8 62.87,50.8 64.14,49.53 73.03,49.53 v74.14,50.64 74.3,50.8
  Bottom 0.254: v116.2,83.82 IC16.11 114.94,76.2 114.94,60.32 116.2,59.05 IC17.11 116.2,55.24 114.94,53.97 114.94,40 116.2,38.73 IC18.11 v116.2,27.94 | v133.99,105.41 133.99,89.53 136.53,86.99 v136.53,83.82 | v74.3,45.72 74.3,50.48 v74.14,50.64
D1  (via drill 0.3)
  Top 0.254: v113.67,30.48 102.23,30.48 99.69,33.02 99.69,37.46 92.71,44.45 IC19.32 83.19,49.53 75.56,49.53 74.3,48.26 IC6.9 | IC8.7 131.44,100.33 v132.72,100.33 | v113.67,85.09 v133.99,85.09
  Bottom 0.254: v113.67,85.09 IC16.12 112.39,76.2 112.39,60.32 113.67,59.05 IC17.12 113.67,55.24 112.39,53.97 112.39,40 113.67,38.73 IC18.12 v113.67,30.48 | IC5.13 68.58,50.8 69.85,52.07 73.03,52.07 73.03,49.85 IC6.9 | v133.99,85.09 133.99,87.63 132.72,88.9 v132.72,100.33
D2  (via drill 0.3)
  Top 0.254: v111.12,33.02 102.23,33.02 100.97,34.29 100.97,38.1 92.08,46.99 IC19.31 80.64,54.61 78.11,54.61 76.83,55.88 IC6.6 | v111.12,85.09 112.39,86.36 115.57,86.36 116.2,85.72 130.18,85.72 130.81,86.36 v131.44,86.36 | IC8.8 v131.44,95.25
  Bottom 0.254: v111.12,85.09 IC16.13 109.86,76.2 109.86,60.32 111.12,59.05 IC17.13 111.12,55.24 109.86,53.97 109.86,40 111.12,38.73 IC18.13 v111.12,33.02 | IC5.14 67.94,53.34 70.48,55.88 IC6.6 | v131.44,95.25 v131.44,86.36
D3  (via drill 0.3)
  Top 0.254: IC6.15 81.92,55.88 IC19.30 91.44,49.53 95.25,45.72 v108.58,45.72 | IC5.7 62.87,53.34 64.14,52.07 v76.83,52.07
  Bottom 0.254: IC16.15 108.58,59.69 109.86,58.42 109.86,55.88 108.58,54.61 v108.58,45.72 IC17.15 108.58,40 109.86,38.73 109.86,22.86 IC18.15 | IC6.15 78.74,55.88 76.83,53.97 v76.83,52.07
D4  (via drill 0.3)
  Top 0.254: IC6.5 74.93,58.42 76.2,57.15 83.19,57.15 IC19.29 90.81,52.07 94.61,48.26 v111.12,48.26
  Bottom 0.254: IC16.16 111.12,60.32 112.39,59.05 112.39,55.24 111.12,53.97 v111.12,48.26 IC17.16 111.12,40 112.39,38.73 112.39,22.86 IC18.16 | IC5.17 68.58,60.96 69.85,62.23 73.03,62.23 73.66,61.59 73.66,60.32 IC6.5
D5  (via drill 0.3)
  Top 0.254: IC6.16 84.45,58.42 IC19.28 90.17,54.61 93.98,50.8 v113.67,50.8 | IC5.4 64.14,60.96 65.41,62.23 73.03,62.23 74.3,60.96 v75.56,60.96
  Bottom 0.254: IC16.17 113.67,60.32 114.94,59.05 114.94,55.24 113.67,53.97 v113.67,50.8 IC17.17 113.67,40 114.94,38.73 114.94,22.86 IC18.17 | IC6.16 78.11,58.42 v75.56,60.96
D6  (via drill 0.3)
  Top 0.254: IC6.2 74.3,66.04 78.11,62.23 83.19,62.23 IC19.27 89.53,57.15 93.34,53.34 v116.2,53.34
  Bottom 0.254: IC16.18 116.2,60.32 117.47,59.05 117.47,55.24 116.2,53.97 v116.2,53.34 IC17.18 116.2,40 117.47,38.73 117.47,22.86 IC18.18 | IC5.18 67.94,63.5 70.48,66.04 IC6.2
D7  (via drill 0.3)
  Top 0.254: IC6.19 81.92,66.04 IC19.26 90.81,62.23 90.81,64.77 100.33,74.29 118.11,74.29 v118.75,73.66 | IC9.12 123.19,100.96 v120.02,100.96 | IC5.3 59.69,63.5 60.96,62.23 62.87,62.23 65.41,64.77 73.03,64.77 v74.3,63.5
  Bottom 0.254: IC18.19 120.02,22.86 120.02,38.73 118.75,40 IC17.19 118.75,53.97 120.02,55.24 120.02,59.05 118.75,60.32 IC16.19 v118.75,73.66 120.02,74.93 120.02,80.01 119.38,80.64 119.38,100.33 v120.02,100.96 | IC6.19 76.83,66.04 v74.3,63.5
DISABLE  (via drill 0.3)
  Top 0.254: U1.8 74.3,22.86 | 74.3,22.86 74.3,26.03 | R5.1 52.07,26.03 70.48,26.03 | 70.48,26.03 74.3,26.03 | 74.3,26.03 74.3,36.19 v76.2,38.1 | v79.38,72.39 69.85,72.39 68.58,73.66 68.58,101.6 67.94,102.23 67.94,111.12 69.22,112.39 v70.48,112.39 | v81.92,111.76 78.74,111.76 v78.11,112.39 | 74.3,22.86 S1.8 70.48,26.03
  Bottom 0.254: IC11.1 v81.92,111.76 | v76.2,38.1 81.92,43.81 81.92,69.85 v79.38,72.39 | v70.48,112.39 71.75,111.12 76.83,111.12 v78.11,112.39
DOTCLK  (via drill 0.3)
  Top 0.254: v33.34,106.04 32.7,106.68 X1.6 | IC15.1 102.23,116.84 99.69,116.84 97.16,114.3 84.45,114.3 81.92,116.84 57.78,116.84 57.15,116.2 v57.15,105.41
  Bottom 0.254: v33.34,106.04 33.97,105.41 49.53,105.41 50.48,104.46 53.34,104.46 54.29,105.41 v57.15,105.41
DRV_64ADDR_HI  (via drill 0.3)
  Top 0.254: IC2.1 21.59,100.33 IC1.1 | v61.59,66.67 60.96,67.31 56.52,67.31 55.24,66.04 52.7,66.04 49.85,68.9 49.85,92.39 48.58,93.66 48.58,96.2 46.99,97.79 v44.45,97.79
  Bottom 0.254: v44.45,97.79 IC2.19 38.42,97.79 35.88,100.33 IC2.1 | IC1.1 16.19,92.71 18.73,90.17 IC1.19 | IC14.18 69.22,34.29 69.22,37.15 63.5,42.86 63.5,64.77 v61.59,66.67
FLAG_SLOW/!FAST  (via drill 0.3)
  Top 0.254: v121.28,91.44 120.02,92.71 v113.67,92.71 | S1.12 62.87,20.32 v62.87,17.14
  Bottom 0.254: IC9.9 v121.28,91.44 | v113.67,92.71 112.39,93.98 109.86,93.98 109.86,89.53 105.41,85.09 105.41,20.32 101.6,16.51 85.72,16.51 85.09,17.14 v62.87,17.14
GND  (via drill 0.3, 0.6)
  Top 0.254: IC11.19 79.38,108.58 v75.56,112.39 | IC15.11 v106.05,92.71 | IC18.20 121.28,26.67 113.03,34.92 110.49,34.92 IC18.14
  Top 0.813: IC7.9 111.12,12.7 | 111.12,12.7 IC7.12 | IC7.7 116.2,12.7 | 116.2,12.7 111.12,12.7 | IC7.5 121.28,12.7 | 121.28,12.7 116.2,12.7 | IC7.3 126.36,12.7 121.28,12.7 | IC19.21 91.44,72.39 102.87,83.82 v106.68,83.82 | IC15.10 v106.05,92.71 | IC5.10 58.74,42.54 | IC6.10 69.85,45.72 C11.2 | IC14.10 56.52,36.83 56.52,41.91 | v55.88,73.66 v55.88,100.96 55.24,101.6 v55.24,113.03 v55.24,114.94 | 33.34,65.41 35.56,65.41 38.1,62.86 38.1,41.59 39.37,41.59 | IC7.14 116.2,12.7 | IC7.16 121.28,12.7 | v39.37,41.91 46.04,41.91 IC4.10
  Top 1.016: X1.A 11.75,119.38 10.79,120.01
  Top 1.27: v106.68,79.38 144.78,79.38 144.78,106.04 C8.2 | v39.37,41.91 56.52,41.91 58.1,41.91 58.74,42.54 C11.2 | IC19.1 v106.68,24.13 | X1.Z 10.79,66.04 10.79,65.41 | IC16.14 108.58,79.06
  Top 2.54: 10.79,120.01 v13.34,120.01 v21.59,120.01 v27.94,120.01 | 10.79,65.41 v13.97,65.41 v24.13,65.41 v33.02,65.41 33.34,65.41 | 39.37,41.59 v39.37,1.9 v74.3,1.9
  Bottom 0.254: IC16.20 121.28,60.32 122.56,59.05 122.56,55.24 121.28,53.97 IC17.20 121.28,40 122.56,38.73 122.56,29.21 121.28,27.94 IC18.20 | v75.56,112.39 73.03,112.39 73.03,120.01 | IC11.8 64.14,119.38 63.5,120.01 | 46.04,21.59 46.02,21.59 S2.1 | S1.14 54.61,22.86 53.34,21.59 46.04,21.59 | 46.04,21.59 45.72,21.27 39.69,21.27 39.37,20.95 | S1.5 S1.6 67.94,2.54 67.31,1.9 | 50.8,72.39 52.7,70.48 53.98,70.48 55.88,72.39 v55.88,73.66 52.07,73.66 50.8,72.39
  Bottom 0.813: IC8.10 127,90.17 127,116.84 | C5.2 118.11,91.44 IC9.7 | C5.2 C6.2 120.02,120.01 | IC15.11 111.12,88.26 v106.68,83.82 | IC4.10 39.37,44.45 38.1,44.45 38.1,62.86 35.56,65.41 33.34,65.41 | C7.2 127,116.84 | IC1.10 v13.97,65.41 | IC2.10 35.88,74.93 41.91,74.93 44.45,72.39 IC3.10 50.8,72.39 | IC11.10 59.05,120.01 | IC7.9 IC7.10 106.68,16.51 | C3.2 85.72,120.01 | v106.05,92.71 106.05,119.7 105.73,120.01 | IC10.7 92.71,96.52 92.71,116.84 | 92.71,116.84 92.71,120.01 | C4.2 92.71,116.84 | C5.2 118.11,120.01 | 127,116.84 127,120.01 | U4.10 v55.88,73.66 | 111.12,5.71 IC7.12 | IC7.14 116.2,5.71 121.28,5.71 IC7.16 | C2.2 v55.88,100.96 | v55.24,114.94 v55.24,113.03 55.24,120.01 | C1.2 39.69,119.7 40.01,120.01
  Bottom 1.27: v106.68,83.82 v106.68,79.38 | v106.68,79.38 106.68,77.47 | 106.68,77.47 106.68,56.83 | 106.68,56.83 106.68,36.83 | 106.68,36.83 v106.68,24.13 106.68,16.51 106.68,5.71 | 106.68,5.71 106.68,1.9 | v74.3,1.9 74.3,15.24 U1.10 76.83,13.97 79.38,11.43 100.33,11.43 101.6,12.7 C10.2 | X1.A 11.11,119.38 10.79,120.01 | 146.05,120.01 146.69,120.01 146.69,108.58 C8.2 | 106.68,5.71 111.12,5.71 116.2,5.71 126.36,5.71 IC7.18 126.36,11.43 132.08,11.43 134.62,8.89 C9.2 | X1.Z 11.43,66.04 10.79,65.41 | v106.68,79.38 106.68,81.28 | IC17.14 107,57.15 106.68,56.83 | IC18.14 106.68,36.83 | 106.68,77.47 IC16.14
  Bottom 2.54: 106.68,1.9 v74.3,1.9 67.31,1.9 v39.37,1.9 39.37,20.95 v39.37,41.91 39.37,44.45 | 10.79,120.01 v13.34,120.01 v21.59,120.01 v27.94,120.01 40.01,120.01 55.24,120.01 59.05,120.01 63.5,120.01 73.03,120.01 85.72,120.01 92.71,120.01 105.73,120.01 118.11,120.01 127,120.01 146.05,120.01 | 10.79,65.41 v13.97,65.41 v24.13,65.41 v33.02,65.41 33.34,65.41
IC15O0
  Bottom 0.254: IC15.12 114.94,99.06 IC9.4
IC15O4  (via drill 0.3)
  Top 0.254: v104.78,88.9 v102.23,88.9 | v101.6,72.39 94.61,65.41 v94.61,64.13 | v88.27,19.05 83.19,24.13 v83.19,27.3
  Bottom 0.254: v104.78,88.9 104.78,89.53 107.31,92.07 107.31,97.79 108.58,99.06 112.39,99.06 114.3,100.96 114.3,102.23 IC9.2 114.94,104.14 113.67,105.41 IC15.16 | v102.23,88.9 102.23,74.29 101.6,73.66 v101.6,72.39 | v94.61,64.13 94.61,56.51 100.33,50.8 100.33,33.02 101.6,31.75 101.6,22.86 97.79,19.05 v88.27,19.05 | IC14.5 70.48,34.29 74.93,29.84 76.2,29.84 76.83,29.21 76.83,26.03 77.47,25.4 81.28,25.4 v83.19,27.3
IC15O6
  Top 0.254: IC10.2 95.89,109.22 97.16,110.49 99.69,110.49 100.97,111.76 109.86,111.76 IC15.18
LATCH_TO_64  (via drill 0.3)
  Top 0.254: v108.58,116.84 107.31,116.84 106.05,118.11 99.69,118.11 96.52,114.94 85.09,114.94 81.92,118.11 55.24,118.11 53.98,116.84 53.98,113.66 50.16,109.85 50.16,99.06 52.07,97.16 52.07,74.29 IC3.11 56.52,69.85 v56.52,69.21 | IC5.11 62.23,45.72 60.96,46.99 57.78,46.99 55.24,44.45 IC4.11
  Bottom 0.254: IC15.19 108.58,115.57 v108.58,116.84 | v56.52,69.21 57.78,70.48 64.14,70.48 64.77,69.85 64.77,47.31 IC5.11
N$52
  Top 0.254: S1.13 57.78,20.32 60.33,17.78 S1.3
  Bottom 0.254: R7.1 45.09,26.67 46.99,24.77 55.24,24.77 57.15,22.86 S1.13
N$65
  Bottom 0.254: IC10.3 90.17,106.68 88.9,105.41 88.9,102.87 90.17,101.6 IC10.5
N$90  (via drill 0.3)
  Top 0.254: IC14.11 IC14.12 60.33,30.48 61.59,31.75 v62.87,31.75 | IC14.9 IC14.8 IC14.7
  Bottom 0.254: v62.87,31.75 IC14.8
PHI0  (via drill 0.3)
  Top 0.254: U1.3 94.61,25.4 IC19.37 | v108.58,94.61 105.41,94.61 104.78,93.98 102.23,93.98 100.97,92.71 86.36,92.71 85.09,93.98 74.3,93.98 v73.03,95.25 72.39,94.61 72.39,78.74 73.66,77.47 81.92,77.47 83.19,78.74 v87,78.74
  Bottom 0.254: U4.2 61.28,93.98 62.55,95.25 v73.03,95.25 | IC15.13 108.58,95.25 v108.58,94.61 | IC19.37 86.36,33.65 86.36,74.29 85.72,74.93 85.72,77.47 v87,78.74
R/!W  (via drill 0.3)
  Top 0.254: v97.16,93.98 87.63,93.98 86.36,95.25 74.93,95.25 73.66,96.52 71.12,96.52 71.12,78.1 72.39,76.83 v72.39,73.66 76.83,73.66 78.11,74.93 85.72,74.93 v87,76.2
  Bottom 0.254: U4.11 v72.39,73.66 | IC10.13 97.16,109.22 97.16,101.6 | IC10.10 97.16,101.6 | IC19.34 87,40.64 v87,76.2 | v97.16,93.98 97.16,101.6
ROM_SEL
  Top 0.254: U1.9 76.83,17.78 70.48,17.78 67.94,20.32 S1.9 66.04,24.77 50.8,24.77 R6.1
SLOW/!FAST
  Bottom 0.254: IC15.9 104.78,93.98 104.78,91.44 103.5,90.17 103.5,87.95 104.78,86.68 104.78,22.22 100.33,17.78 87,17.78 86.36,18.41 64.77,18.41 63.5,19.68 59.05,19.68 57.78,18.41 S1.2
VCC  (via drill 0.3)
  Top 0.254: v10.48,78.74 10.48,78.1 13.65,74.93 IC1.8 | IC1.20 19.05,92.71 16.51,90.17 IC1.2 | IC2.15 39.37,87.63 36.83,90.17 | 36.83,90.17 34.29,87.63 IC2.6 | 36.83,90.17 36.83,92.71 | 36.83,92.71 36.83,97.79 | IC2.4 36.83,92.71 | IC2.17 36.83,92.71 | R2.2 52.07,120.01 | R7.2 R6.2 R5.2 41.91,38.1 41.91,15.24 44.45,12.7 47.62,12.7 50.16,10.16 v76.83,10.16 | IC14.6 67.94,34.92 69.85,33.02 71.12,33.02 73.03,34.92 IC14.4 | IC2.11 41.91,77.47 43.81,79.38 v43.81,80.01 43.81,80.64 41.91,82.55 IC2.13 IC2.8 27.62,82.55 25.08,85.09 IC1.17 IC1.4 17.78,85.09 v17.78,81.28 | IC1.13 20.95,74.93 17.78,71.75 v17.78,71.12
  Top 0.305: X1.3 2.87,115.58 | X1.2 2.87,115.58 | 2.87,115.58 3.81,115.57
  Top 0.61: IC1.20 24.77,92.71 29.84,97.79 IC2.2 36.83,97.79 39.37,100.33 IC2.20 | IC5.20 67.31,68.58 69.85,71.12 76.83,71.12 IC6.20 | C2.1 48.9,102.55
  Top 0.813: IC4.20 51.12,69.85 v51.12,78.42 v51.12,95.25 51.12,95.57 48.9,97.79 48.9,102.55 48.9,120.01 | C5.1 111.12,116.84 | 111.12,116.84 111.12,120.01 | IC15.20 111.12,116.84 | C4.1 95.89,120.01 | C6.1 125.09,120.01 | IC8.20 134.62,114.94 C7.1 134.62,120.01 | IC16.28 146.69,62.23 | IC17.28 146.69,41.91 | IC19.8 104.78,41.91 107.31,39.37 146.69,39.37 | IC18.28 146.37,21.59 146.69,21.27 | C3.1 81.92,107.95 IC11.20 | v88.27,116.84 88.27,120.01 | U4.20 64.77,96.52 64.77,70.17 IC5.20 | 33.02,115.57 34.29,115.57 C1.1
  Top 1.27: 146.69,13.97 C9.1 131.44,13.97 IC7.20 131.44,6.35 105.41,6.35 C10.1 U1.20 | C8.1 146.69,111.12
  Top 1.422: 146.05,120.01 146.69,120.01 146.69,111.12 146.69,62.23 146.69,41.91 146.69,39.37 146.69,21.27 146.69,13.97
  Top 2.54: 33.02,115.57 33.02,120.01 48.9,120.01 52.07,120.01 88.27,120.01 95.89,120.01 111.12,120.01 125.09,120.01 134.62,120.01 146.05,120.01
  Top 2.794: 3.81,115.57 33.02,115.57
  Bottom 0.254: v10.48,78.74 11.75,80.01 IC1.6 17.78,80.01 | R3.2 140.34,111.76 137.79,111.76 IC8.20 | v17.78,71.12 17.78,70.48 18.41,69.85 IC1.11 | IC1.8 IC1.13 | 17.78,80.01 IC1.15 | v17.78,81.28 17.78,80.01 | v43.81,80.01 45.09,78.74 50.8,78.74 v51.12,78.42 | C10.1 102.23,9.52 77.47,9.52 v76.83,10.16
  Bottom 0.61: IC4.20 53.66,68.9 56.52,71.75 65.72,71.75 66.36,71.12 IC5.20 | IC6.20 80.64,68.58 80.64,44.45 78.74,42.54 C11.1
  Bottom 0.813: IC9.14 125.09,107.95 R1.2 R4.2 C6.1 | IC2.20 46.35,100.33 C2.1 | IC10.14 98.42,114.3 C4.1 | C3.1 88.27,114.3 v88.27,116.84 | C11.1 73.66,40.64 | IC14.4 73.03,33.65 74.93,31.75 78.11,31.75 80.64,29.21 IC14.20 | IC3.20 v51.12,95.25
  Bottom 1.27: 73.66,40.64 73.66,35.56 IC14.4
WEAK_HI  (via drill 0.3)
  Top 0.254: v108.58,110.49 IC15.3 101.6,110.49 99.06,107.95 v88.27,107.95 | IC8.18 IC8.3 | IC11.17 IC11.4 | IC8.17 135.25,104.14 127,104.14 125.73,102.87 121.92,102.87 v121.28,103.5 | v121.28,106.68 IC9.1
  Bottom 0.254: IC9.1 116.2,109.22 R1.1 113.67,109.22 109.86,109.22 v108.58,110.49 | IC8.13 IC8.14 135.25,99.06 135.25,104.14 IC8.17 IC8.18 | IC11.13 66.04,104.77 72.39,104.77 IC11.17 | IC11.4 74.3,114.94 76.2,116.84 77.47,116.84 79.38,114.94 IC11.2 79.38,111.12 80.64,109.85 88.27,109.85 v88.27,107.95 | IC9.10 121.92,98.42 121.92,102.87 v121.28,103.5 v121.28,106.68 | IC15.6 104.78,104.14 104.78,109.22 IC15.3